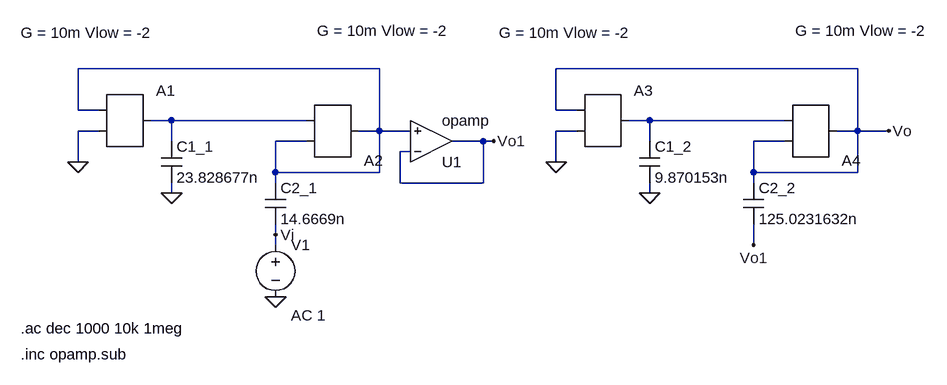
[diagram p0: schematic Ej8.asc]
Ej8.asc, the LTspice schematic file:
Version 4
SHEET 1 1748 680
WIRE 560 64 96 64
WIRE 1296 64 832 64
WIRE 96 128 96 64
WIRE 128 128 96 128
WIRE 832 128 832 64
WIRE 864 128 832 128
WIRE 240 144 208 144
WIRE 448 144 240 144
WIRE 976 144 944 144
WIRE 1184 144 976 144
WIRE 128 160 96 160
WIRE 560 160 560 64
WIRE 560 160 528 160
WIRE 608 160 560 160
WIRE 864 160 832 160
WIRE 1296 160 1296 64
WIRE 1296 160 1264 160
WIRE 1344 160 1296 160
WIRE 240 176 240 144
WIRE 448 176 400 176
WIRE 720 176 672 176
WIRE 736 176 720 176
WIRE 976 176 976 144
WIRE 1184 176 1136 176
WIRE 608 192 592 192
WIRE 96 208 96 160
WIRE 832 208 832 160
WIRE 400 224 400 176
WIRE 560 224 560 160
WIRE 560 224 400 224
WIRE 1136 224 1136 176
WIRE 1296 224 1296 160
WIRE 1296 224 1136 224
WIRE 400 240 400 224
WIRE 592 240 592 192
WIRE 720 240 720 176
WIRE 720 240 592 240
WIRE 1136 240 1136 224
WIRE 240 256 240 240
WIRE 976 256 976 240
WIRE 400 320 400 304
WIRE 400 336 400 320
WIRE 1136 336 1136 304
FLAG 96 208 0
FLAG 736 176 Vo1
FLAG 240 256 0
FLAG 400 320 Vi
FLAG 400 416 0
FLAG 832 208 0
FLAG 976 256 0
FLAG 1136 336 Vo1
FLAG 1344 160 Vo
SYMBOL SpecialFunctions\\ota 160 80 R0
WINDOW 3 -152 -71 Left 2
SYMATTR Value G = 10m Vlow = -2
SYMATTR InstName A1
SYMBOL SpecialFunctions\\ota 480 224 M180
WINDOW 3 -16 218 Left 2
SYMATTR Value G = 10m Vlow = -2
SYMATTR InstName A2
SYMBOL cap 224 176 R0
SYMATTR InstName C1_1
SYMATTR Value 23.828677n
SYMBOL cap 384 240 R0
SYMATTR InstName C2_1
SYMATTR Value 14.6669n
SYMBOL voltage 400 320 R0
WINDOW 123 24 124 Left 2
WINDOW 39 0 0 Left 0
SYMATTR Value2 AC 1
SYMATTR InstName V1
SYMATTR Value ""
SYMBOL SpecialFunctions\\ota 896 80 R0
WINDOW 3 -152 -71 Left 2
SYMATTR Value G = 10m Vlow = -2
SYMATTR InstName A3
SYMBOL SpecialFunctions\\ota 1216 224 M180
WINDOW 3 -16 218 Left 2
SYMATTR Value G = 10m Vlow = -2
SYMATTR InstName A4
SYMBOL cap 960 176 R0
SYMATTR InstName C1_2
SYMATTR Value 9.870153n
SYMBOL cap 1120 240 R0
SYMATTR InstName C2_2
SYMATTR Value 125.0231632n
SYMBOL OpAmps\\opamp 640 240 M180
SYMATTR InstName U1
TEXT 8 464 Left 2 !.ac dec 1000 10k 1meg
TEXT 8 504 Left 2 !.inc opamp.sub

The netlist it stands for:
* Ej8.asc
A1 N001 0 0 0 0 0 N002 0 OTA G = 10m Vlow = -2
A2 N001 N002 0 0 0 0 N001 0 OTA G = 10m Vlow = -2
C1_1 N002 0 23.828677n
C2_1 N001 Vi 14.6669n
V1 Vi 0 AC 1
A3 Vo 0 0 0 0 0 N003 0 OTA G = 10m Vlow = -2
A4 Vo N003 0 0 0 0 Vo 0 OTA G = 10m Vlow = -2
C1_2 N003 0 9.870153n
C2_2 Vo Vo1 125.0231632n
XU1 Vo1 N001 Vo1 opamp Aol=100K GBW=10Meg  ; pins invin noninvin out
.ac dec 1000 10k 1meg
.inc opamp.sub
.backanno
.end